# EAGLE design bpsensor (EAGLE 4.13)
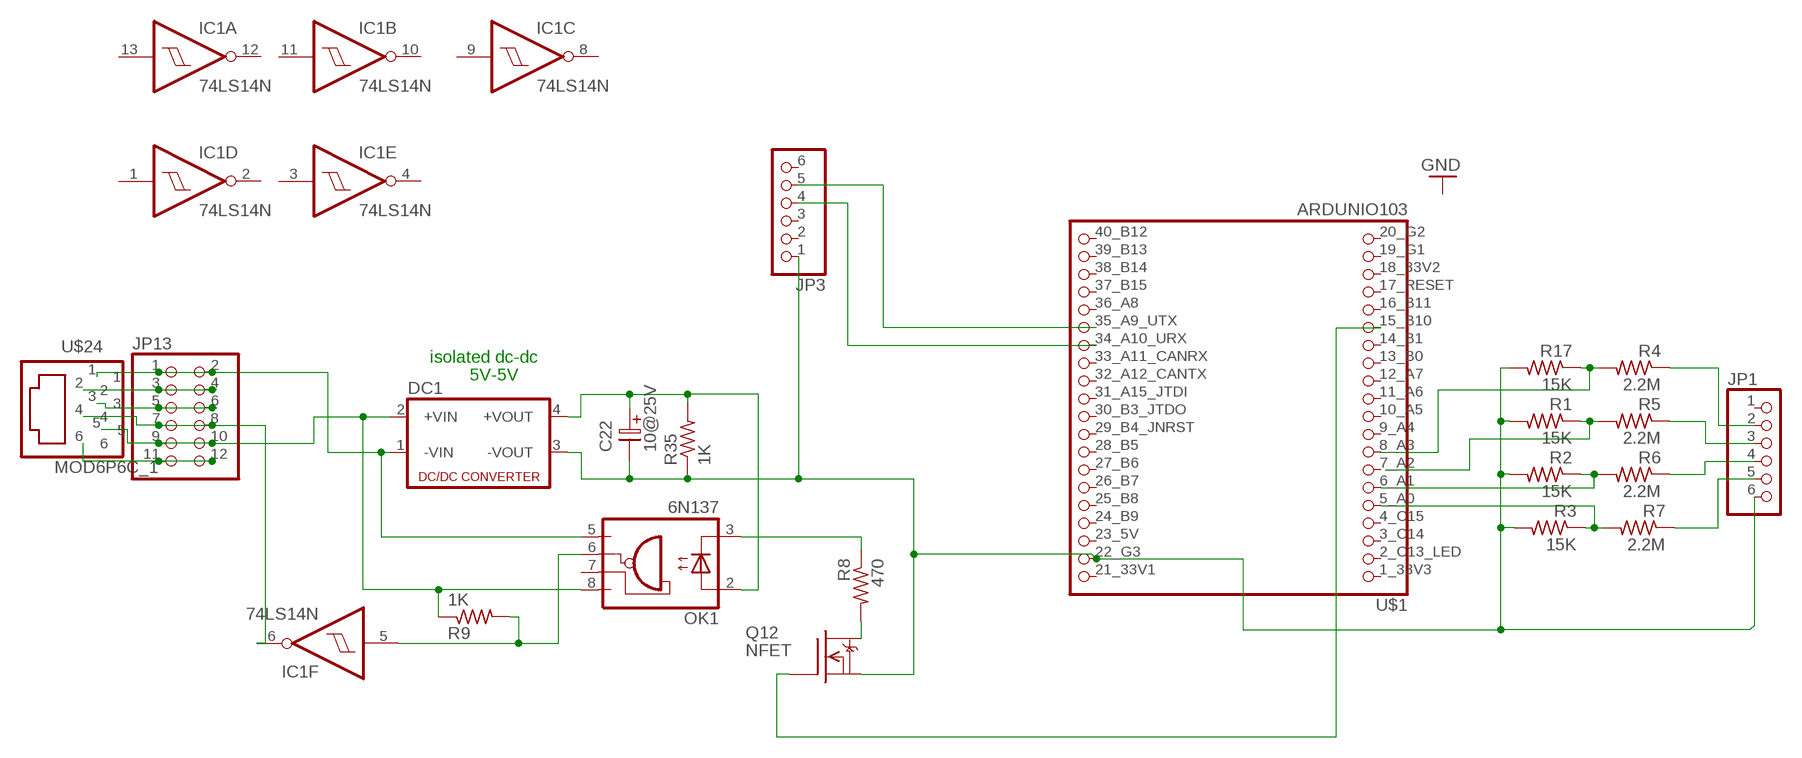
[diagram p0: schematic, sheet 1]

## Parts
C22  10@25V  ELC-2,5L  [ES-2,5L]
DC1  NME  [NME]
IC1  74LS14N  [DIL14]
JP1  PINHD-1X6  [1X06]
JP3  PINHD-1X6  [1X06]
JP13  PINHD-2X6  [2X06]
OK1  6N137  [DIL08]
Q12  NFET  DMN3404L  [SOT-23]
R1  15K  R-US_R0603  [R0603]
R2  15K  R-US_R0603  [R0603]
R3  15K  R-US_R0603  [R0603]
R4  2.2M  R-US_R0603  [R0603]
R5  2.2M  R-US_R0603  [R0603]
R6  2.2M  R-US_R0603  [R0603]
R7  2.2M  R-US_R0603  [R0603]
R8  470  R-US_R0603  [R0603]
R9  1K  R-US_R0603  [R0603]
R17  15K  R-US_R0603  [R0603]
R35  1K  R-US_R0603  [R0603]
U$1  ARDUNIO103  [ARDUNIO103]
U$24  MOD6P6C_1  [MOD6P6C_1]

## Nets
+5V: DC1.2(+VIN) JP13.9 JP13.10 OK1.8(VCC) R9.1 U$24.5
+12V: JP13.11 JP13.12 U$24.6
B7BUF: JP13.3 JP13.4 U$24.2
DIV2: IC1.6(F:O) JP13.7 JP13.8 U$24.4
GND: DC1.1(-VIN) JP13.1 JP13.2 JP13.5 JP13.6 OK1.5(GND) U$24.1 U$24.3
GNDB: C22.2 DC1.3(-VOUT) JP1.6 JP3.1 Q12.2(S) R1.2 R2.2 R3.2 R17.2 R35.1 U$1.22_G3
ISO_PLUS_5V: C22.1 DC1.4(+VOUT) OK1.2(A) R35.2
N$1: OK1.3(C) R8.1
N$2: Q12.3(D) R8.2
N$3: R4.2 R17.1 U$1.8_A3
N$4: Q12.1(G) U$1.15_B10
N$5: IC1.5(F:I) OK1.6(VO) R9.2
N$6: R1.1 R5.2
N$7: R2.1 R6.2 U$1.6_A1
N$8: R3.1 R7.2 U$1.5_A0
N$10: JP1.5 R7.1
N$11: JP1.4 R6.1
N$12: JP1.3 R5.1
N$13: JP1.2 R4.1
PA9_USART1_TX: JP3.5 U$1.35_A9_UTX
PA10_USART1_RX: JP3.4 U$1.34_A10_URX
Unconnected: IC1.1(D:I) IC1.2(D:O) IC1.3(E:I) IC1.4(E:O) IC1.8(C:O) IC1.9(C:I) IC1.10(B:O) IC1.11(B:I) IC1.12(A:O) IC1.13(A:I) JP1.1 JP3.2 JP3.3 JP3.6 OK1.7(VE) U$1.1_33V3 U$1.2_C13_LED U$1.3_C14 U$1.4_C15 U$1.7_A2 U$1.9_A4 U$1.10_A5 U$1.11_A6 U$1.12_A7 U$1.13_B0 U$1.14_B1 U$1.16_B11 U$1.17_RESET U$1.18_33V2 U$1.19_G1 U$1.20_G2 U$1.21_33V1 U$1.23_5V U$1.24_B9 U$1.25_B8 U$1.26_B7 U$1.27_B6 U$1.28_B5 U$1.29_B4_JNRST U$1.30_B3_JTDO U$1.31_A15_JTDI U$1.32_A12_CANTX U$1.33_A11_CANRX U$1.36_A8 U$1.37_B15 U$1.38_B14 U$1.39_B13 U$1.40_B12

## Notes on the sheet
- isolated dc-dc
- 5V-5V

## Power pins joined to a net without a drawn wire
GND: IC1.7(P:GND)
VCC: IC1.14(P:VCC)

## Library data of the parts
C22 = DEH:ELC-2,5L
DC1 = dc-dc-converter:NME: DC-DC CONVERTER
IC1 = 74xx-us:74*14: Hex schmitt trigger INVERTER
JP1 JP3 = pinhead:PINHD-1X6: PIN HEADER
JP13 = pinhead:PINHD-2X6: PIN HEADER
OK1 = optocoupler-2:6N137: MOTOROLA OPTO COUPLER
Q12 = transistor-fet:DMN3404L
R1-R9 R17 R35 = rcl:R-US_: RESISTOR, American symbol
U$1 = pinhead:ARDUNIO103
U$24 = DEH:MOD6P6C_1

## Board
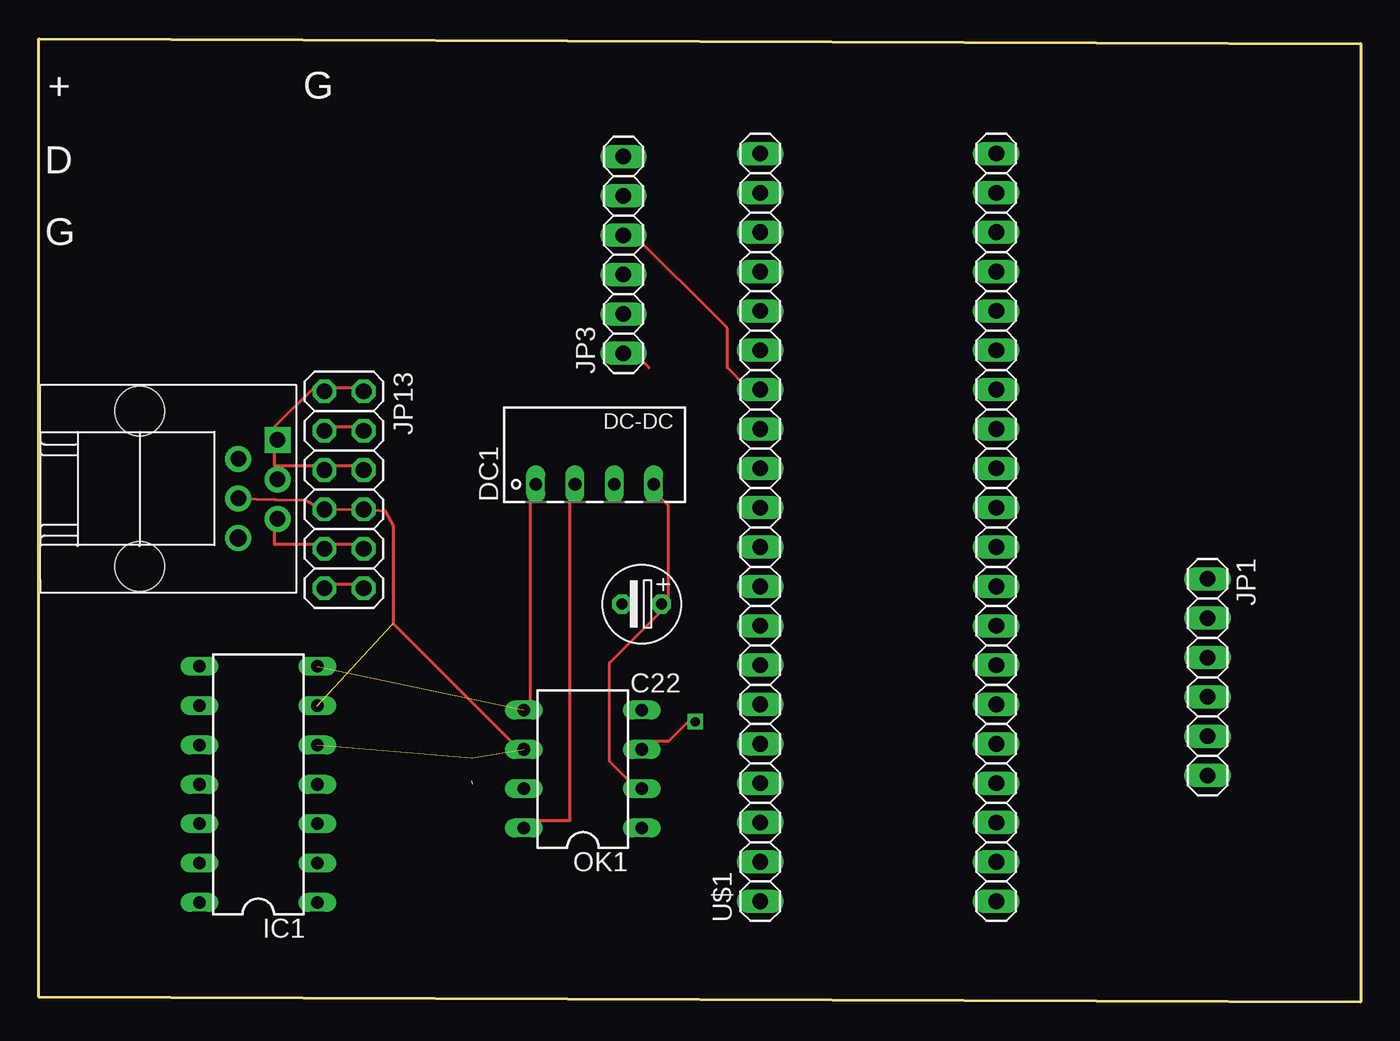
[diagram p1: board, top side]
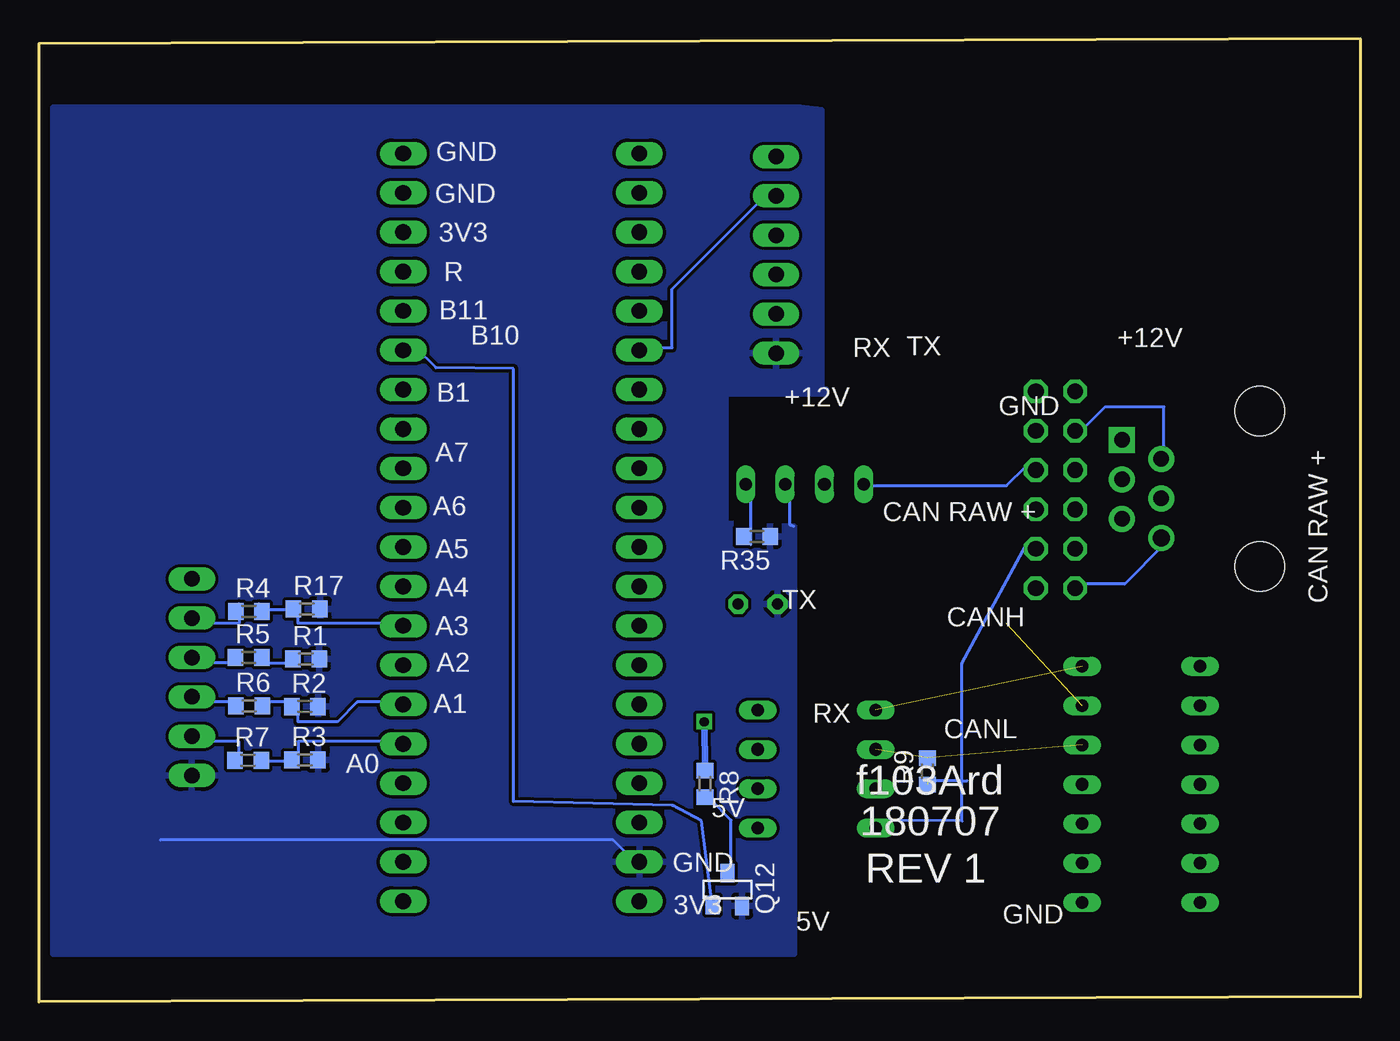
[diagram p2: board, bottom side, seen from below]

Size 85.32 x 62.17 mm. Coordinates in mm from the lower left corner, seen from the top.
Outline: 0,0.32 0,62.17 85.32,61.85 85.32,0 0,0.32
Copper layers (1*16): Top 0.035mm / dielectric 1.5mm / Bottom 0.035mm
Design rules "default": minimum track width 8mil, minimum drill 0.6mm, track to track 8mil, track to pad 8mil, pad to pad 10mil, via to via 8mil, smd to smd 0mil, copper to edge 8mil, drill to drill 8mil, minimum pad ring 8mil, minimum via ring 8mil, stop-mask expansion 4mil, vias tented up to drill 0mil, thermal gap 10mil

### Footprints (pad centres in the part's own frame; a part is rotated, then mirrored left to right if it is on the bottom)
ES-2,5L = drill 0.711 pad 1.27 octagon: 1 0,0; 2 2.54,0
NME = drill 0.813 long: 1 0,3.81; 2 0,1.27; 3 0,-1.27; 4 0,-3.81
DIL14 = drill 0.813 long: 1 -7.62,-3.81; 2 -5.08,-3.81; 3 -2.54,-3.81; 4 0,-3.81; 5 2.54,-3.81; 6 5.08,-3.81; 7 7.62,-3.81; 8 7.62,3.81; 9 5.08,3.81; 10 2.54,3.81; 11 0,3.81; 12 -2.54,3.81; 13 -5.08,3.81; 14 -7.62,3.81
1X06 = drill 1 long: 1 -6.35,0; 2 -3.81,0; 3 -1.27,0; 4 1.27,0; 5 3.81,0; 6 6.35,0
2X06 = drill 1.016 octagon: 1 -6.35,-1.27; 2 -6.35,1.27; 3 -3.81,-1.27; 4 -3.81,1.27; 5 -1.27,-1.27; 6 -1.27,1.27; 7 1.27,-1.27; 8 1.27,1.27; 9 3.81,-1.27; 10 3.81,1.27; 11 6.35,-1.27; 12 6.35,1.27
DIL08 = drill 0.813 long: 1 -3.81,-3.81; 2 -1.27,-3.81; 3 1.27,-3.81; 4 3.81,-3.81; 5 3.81,3.81; 6 1.27,3.81; 7 -1.27,3.81; 8 -3.81,3.81
SOT-23 = smd 0.9 x 1.2: 1 -1,-1.006; 2 0.9,-1.056; 3 -0.05,1.056
R0603 = smd 1 x 1.1: 1 -0.85,0; 2 0.85,0
ARDUNIO103 = drill 1.016 long: 1_33V3 -21.59,-7.62; 2_C13_LED -19.05,-7.62; 3_C14 -16.51,-7.62; 4_C15 -13.97,-7.62; 5_A0 -11.43,-7.62; 6_A1 -8.89,-7.62; 7_A2 -6.35,-7.62; 8_A3 -3.81,-7.62; 9_A4 -1.27,-7.62; 10_A5 1.27,-7.62; 11_A6 3.81,-7.62; 12_A7 6.35,-7.62; 13_B0 8.89,-7.62; 14_B1 11.43,-7.62; 15_B10 13.97,-7.62; 16_B11 16.51,-7.62; 17_RESET 19.05,-7.62; 18_33V2 21.59,-7.62; 19_G1 24.13,-7.62; 20_G2 26.67,-7.62; 21_33V1 -21.59,7.62; 22_G3 -19.05,7.62; 23_5V -16.51,7.62; 24_B9 -13.97,7.62; 25_B8 -11.43,7.62; 26_B7 -8.89,7.62; 27_B6 -6.35,7.62; 28_B5 -3.81,7.62; 29_B4_JNRST -1.27,7.62; 30_B3_JTDO 1.27,7.62; 31_A15_JTDI 3.81,7.62; 32_A12_CANTX 6.35,7.62; 33_A11_CANRX 8.89,7.62; 34_A10_URX 11.43,7.62; 35_A9_UTX 13.97,7.62; 36_A8 16.51,7.62; 37_B15 19.05,7.62; 38_B14 21.59,7.62; 39_B13 24.13,7.62; 40_B12 26.67,7.62
MOD6P6C_1 = drill 1 pad 1.676 square: 1 -3.175,8.898 | drill 1 pad 1.676 round: 2 -1.951,6.358; 3 -0.627,8.898; 4 0.597,6.358; 5 1.921,8.898 | drill 1.1 pad 1.676 round: 6 3.145,6.358 | hole 3.2: -5.029,-0.01; 4.999,-0.01

### Placement (x,y rotation side)
C22  40.18,25.68 180 top
DC1  35.88,33.42 90 top
IC1  14.17,14.04 90 top
JP1  75.44,20.96 270 top
JP3  37.74,48.22 90 top
JP13  19.7,33.06 270 top
OK1  35.12,15.03 90 top
Q12  40.83,7.25 0 bottom
R1  68.07,22.13 0 bottom
R2  68.14,19.06 0 bottom
R3  68.14,15.62 0 bottom
R4  71.76,25.21 0 bottom
R5  71.77,22.25 0 bottom
R6  71.74,19.12 0 bottom
R7  71.81,15.59 0 bottom
R8  42.31,14.08 270 bottom
R9  27.98,14.89 90 bottom
R17  68.02,25.37 0 bottom
R35  38.97,30.05 180 bottom
U$1  54.18,28.09 90 top
U$24  6.52,33.1 270 top

### Tracks (layer width: path | path; a pad name or v marks a point on that pad's centre or on a via)
+5V  (1 unrouted)
  Top 0.203: JP13.10 20.32,29.51 19.05,29.51 JP13.9 17.78,29.51 15.24,29.51 15.24,30.78 U$24.5 | OK1.8 31.75,11.73 34.29,11.73 34.29,33.32 DC1.2
  Bottom 0.203: 25.73,14.27 25.73,11.68 30.48,11.73 OK1.8 | 25.73,14.27 25.73,21.84 21.59,29.51 JP13.10 | 25.73,14.27 27.94,14.27 | 25.73,14.27 25.4,14.27
+12V
  Top 0.203: JP13.11 19.05,26.97 20.32,26.97 JP13.12
  Bottom 0.203: U$24.6 12.7,29.51 15.24,26.97 17.78,26.97 JP13.11
B7BUF
  Top 0.203: JP13.3 19.05,37.13 20.32,37.13 JP13.4
  Bottom 0.203: U$24.2 12.7,35.86 12.7,38.4 16.51,38.4 17.78,37.13 JP13.3
DIV2  (1 unrouted)
  Top 0.203: U$24.4 15.24,32.43 17.23,32.4 18.42,31.73 JP13.7 21.08,31.81 | 21.08,31.81 JP13.8 | 30.48,16.81 22.86,24.43 22.86,30.74 | 22.86,30.74 22.86,30.78 | 21.08,31.81 22.37,31.7 22.88,30.74 22.86,30.74
  Bottom 0.203: JP13.8 20.95,31.78
GND  (1 unrouted)
  Top 0.203: JP13.2 20.32,39.67 19.05,39.67 JP13.1 17.78,39.67 15.24,37.13 15.24,35.86 | JP13.6 20.32,34.59 19.05,34.59 JP13.5 17.78,34.59 15.24,34.59 | 15.24,34.59 15.24,35.86 | 15.24,34.59 15.24,33.32 U$24.3 | 15.24,35.86 U$24.1 | OK1.5 31.75,19.35 31.75,33.32 DC1.1
  Bottom 0.203: JP13.6 21.59,34.59 22.86,33.32 31.75,33.32 DC1.1
GNDB
  Top 0.203: 39.37,40.94 38.1,42.21 JP3.1 | U$1.22_G3 45.72,9.19
  Bottom 0.203: 77.47,10.46 48.26,10.46 46.99,9.19 U$1.22_G3 | DC1.3 36.83,33.32 36.83,30.78 36.58,30.7
  pour Bottom: 36.18,57.72 84.39,57.72 84.39,3.11 36.58,3.11 36.58,30.7 40.51,30.7 40.51,30.86 40.99,30.86 40.99,39.28 34.5,39.28 34.5,39.52 34.82,39.52 34.82,57.56 36.15,57.71
ISO_PLUS_5V
  Top 0.203: 40.64,25.7 36.83,21.89 36.83,15.54 38.1,14.27 OK1.2 | 40.64,25.7 40.64,32.05 39.37,33.32 DC1.4 | 40.64,25.7 C22.1
  Bottom 0.203: R35.2 39.37,29.51 39.37,33.32 DC1.4
N$1  (via drill 0.6)
  Top 0.203: v42.36,18.08 41.91,18.08 40.64,16.81 39.37,16.81 OK1.3
  Bottom 0.406: R8.1 v42.36,18.08
N$2
  Bottom 0.203: R8.2 41.91,13 40.64,11.73 40.64,7.92 Q12.3
N$3
  Bottom 0.203: 68.58,25.7 68.65,25.3 71.19,25.3 71.12,25.7 R4.2 | 68.58,25.7 68.58,24.43 62.23,24.43 U$1.8_A3 | 68.58,25.7 R17.1
N$4
  Bottom 0.203: Q12.1 41.91,6.65 42.55,11.68 44.43,12.68 54.68,12.94 54.68,40.88 59.69,40.94 60.96,42.21 U$1.15_B10
N$5  (2 unrouted)
N$6
  Bottom 0.203: R1.1 68.58,21.89 71.12,21.89 R5.2
N$7
  Bottom 0.203: 68.58,19.35 71.12,19.35 R6.2 | 68.58,19.35 68.58,18.08 66.04,18.08 64.77,19.35 62.23,19.35 U$1.6_A1 | 68.58,19.35 R2.1
N$8
  Bottom 0.203: 68.58,15.54 71.12,15.54 R7.2 | 68.58,15.54 68.58,16.81 62.23,16.81 U$1.5_A0 | 68.58,15.54 R3.1
N$10
  Bottom 0.203: R7.1 72.39,15.54 72.39,16.81 74.93,16.81 JP1.5
N$11
  Bottom 0.203: R6.1 72.39,19.35 74.93,19.35 JP1.4
N$12
  Bottom 0.203: R5.1 72.39,21.89 74.93,21.89 JP1.3
N$13
  Bottom 0.203: R4.1 72.39,25.7 72.39,24.43 74.93,24.43 JP1.2
PA9_USART1_TX
  Bottom 0.203: JP3.5 38.1,52.37 44.45,46.02 44.45,42.21 45.72,42.21 U$1.35_A9_UTX
PA10_USART1_RX
  Top 0.203: JP3.4 38.1,49.83 44.45,43.48 44.45,40.94 45.72,39.67 U$1.34_A10_URX

### Text on the board
tNames: + | G | D | G
bNames: GND | GND | 3V3 | DIV2 | R | B9BUF | B7BUF | B11 | +12V | B10 | DIV6 | TX | RX | GND | +12V | B1 | CAN RAW + | A7 | 12V | 5V | CAN RAW + | A6 | A5 | A4 | TX | CANH | A3 | A2 | RX | A1 | CANL | A0 | f103Ard | 5V | B8BUF | B5BUF | DIV1 | 180707 | DIV5 | GND | REV 1 | GND | 3V3 | 5V | 5V | 5V
bStop: f103Ard | 07/01/2018